# EAGLE design topboard-v1 (EAGLE 9.4.0)
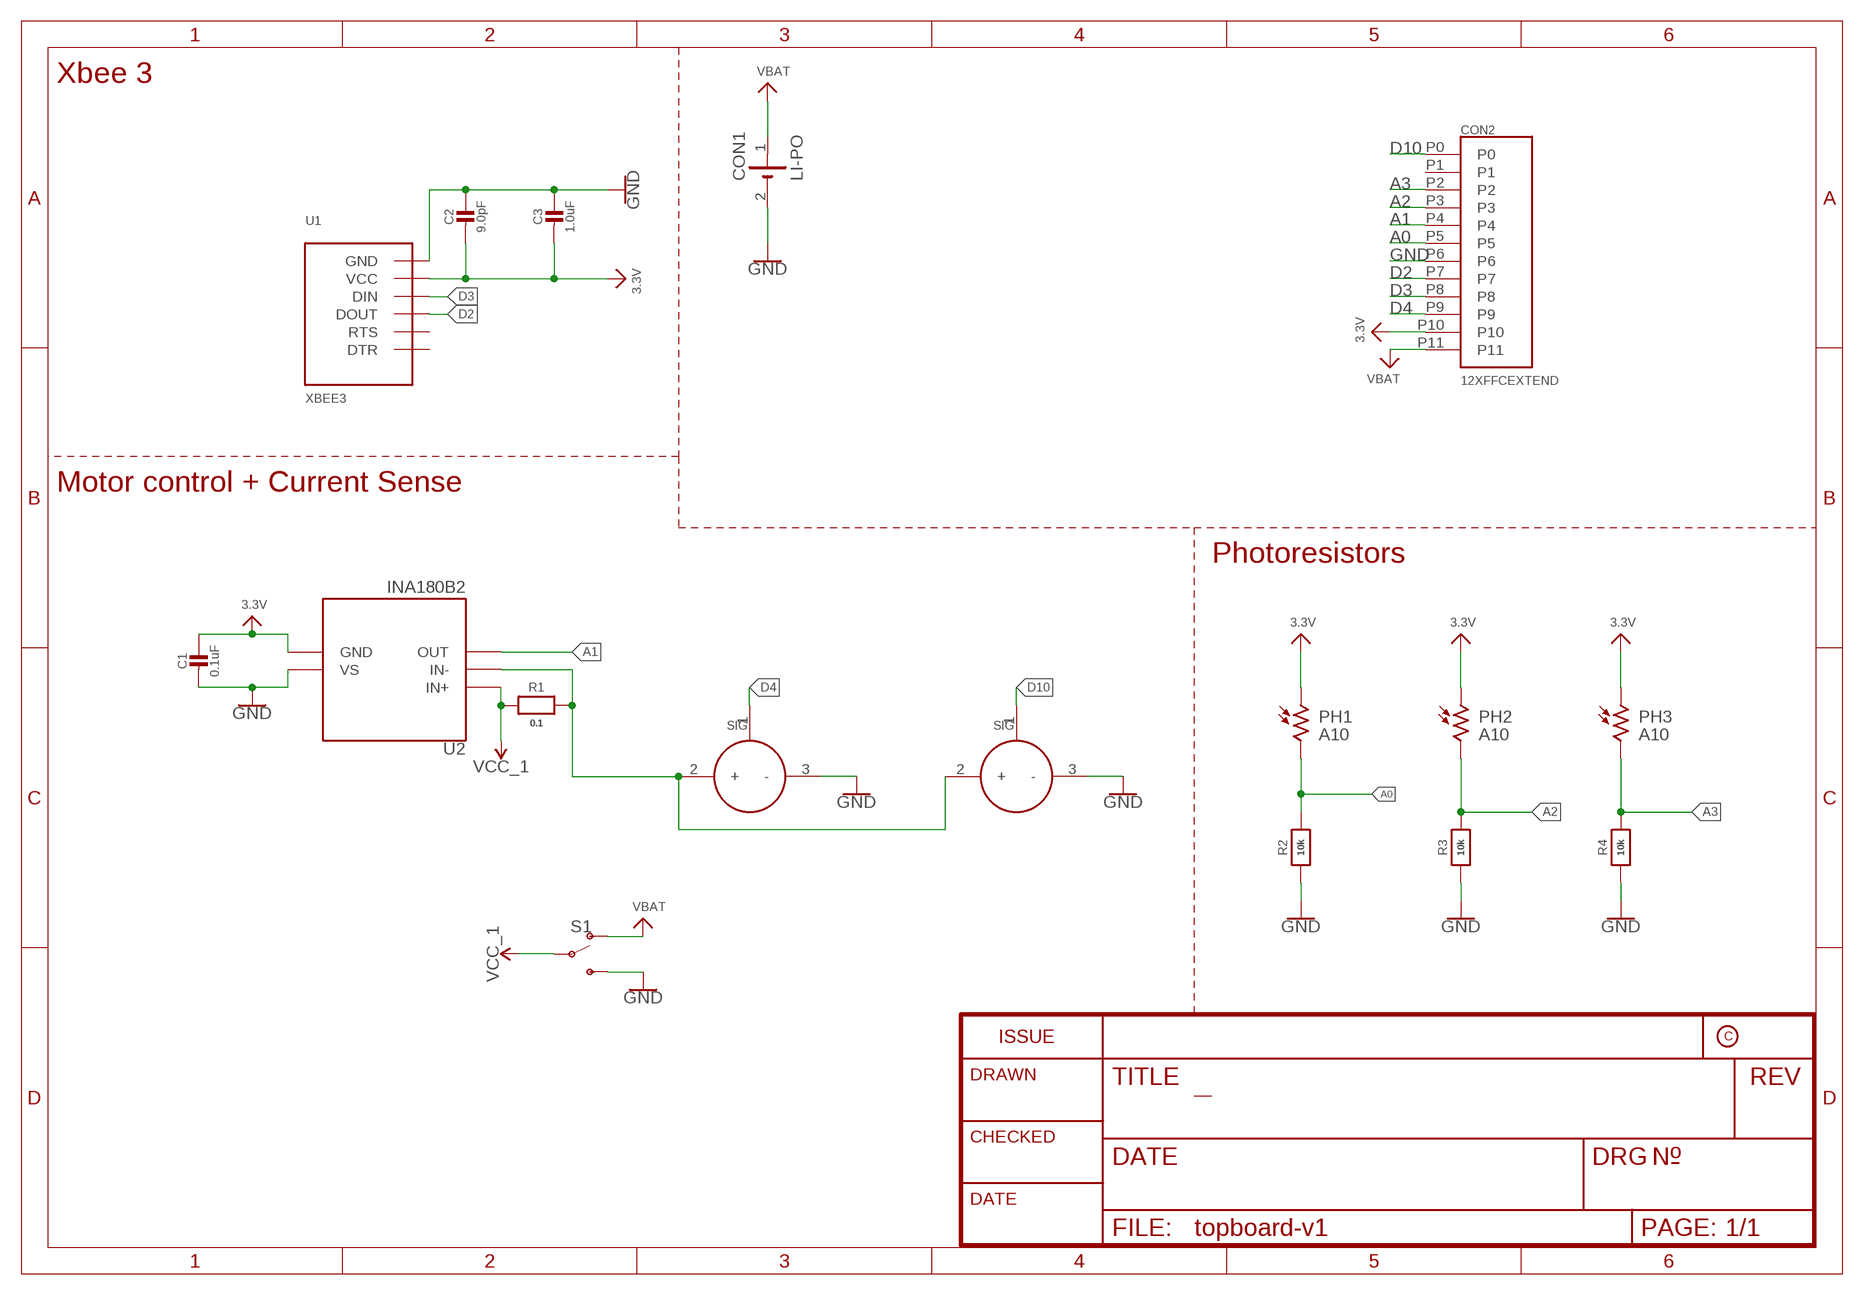
[diagram p0: schematic, sheet 1]

## Parts
C1  0.1uF  CAP_CERAMIC_0603MP  [_0603MP]
C2  9.0pF  CAP_CERAMIC_0603MP  [_0603MP]
C3  1.0uF  CAP_CERAMIC_0603MP  [_0603MP]
CON1  LI-PO  [1X02_BATT]
CON2  12XFFCEXTEND  [15166-0117_XTEND]
M1  SERVO  [1X03_SERVO]
M2  SERVO  [1X03_SERVO]
PH1  A10  [PHOTORESISTOR]
PH2  A10  [PHOTORESISTOR]
PH3  A10  [PHOTORESISTOR]
R1  0.1  RESISTOR_0603MP  [_0603MP]
R2  10k  RESISTOR_0603MP  [_0603MP]
R3  10k  RESISTOR_0603MP  [_0603MP]
R4  10k  RESISTOR_0603MP  [_0603MP]
S1  SWITCH-SPDT-SMD-RIGHT-ANGLE  [SWITCH_SPST_SMD_A]
U1  XBEE3  [XBEE3_MICRO]
U2  INA180B2  [SOT23-5]

## Nets
3.3V: C1.1 C2.2 C3.2 CON2.P10 PH1.1 PH2.1 PH3.1 U1.VCC U2.2(GND)
A0: CON2.P5 PH1.2 R2.2
A1: CON2.P4 U2.4(OUT)
A2: CON2.P3 PH2.2 R3.2
A3: CON2.P2 PH3.2 R4.2
D2: CON2.P7 U1.DOUT/DIO13(DOUT)
D3: CON2.P8 U1.DIN/CONFIG/DIO14(DIN)
D4: CON2.P9 M1.1(SIG)
D10: CON2.P0 M2.1(SIG)
GND: C1.2 C2.1 C3.1 CON1.2(-) CON2.P6 M1.3(-) M2.3(-) R2.1 R3.1 R4.1 S1.3(S) U1.GND1(GND) U1.GND2(GND) U1.GND3(GND) U1.GND4(GND) U1.GND5(GND) U1.GND6(GND) U2.5(VS)
N$1: M1.2(+) M2.2(+) R1.2 U2.3(IN-)
VBAT: CON1.1(+) CON2.P11 S1.1(O)
VCC_1: R1.1 S1.2(P) U2.1(IN+)
Unconnected: CON2.P1 U1.DTR/SLEEP_RQ/DIO8(DTR) U1.RTS/DIO6(RTS)

## Notes on the sheet
- Xbee 3
- Motor control + Current Sense
- Photoresistors

## Library data of the parts
C1-C3 = NU-Smarticle v2:CAP_CERAMIC: Ceramic Capacitors For new designs, use the packages preceded by an '_' character since they are more reliable: The following footprints should be used on most boards: _0402 - Standard footprint for regular board layouts _0603 - Standard footprint for regular board layouts _0805 - Standard footprint for regular board layouts _1206 - Standard footprint for regular board layouts For extremely tight-pitch boards where space is at a premium, the following 'micro-pitch' footprints can be used (smaller pads, no silkscreen outline, etc.): _0402MP - Micro-pitch footprint for very dense/compact boards _0603MP - Micro-pitch footprint for very dense/compact boards _0805MP - Micro-pitch footprint for very dense/compact boards _1206MP - Micro-pitch footprint for very dense/compact boards
CON1 = NU-Smarticle v2:LI-PO: Pins connecting to LiPo Battery
CON2 = NU-Smarticle v2:12XFFC
M1 M2 = NU-Smarticle v2:SERVO
PH1-PH3 = NU-Smarticle v2:A10: Sensor Robust Light Sensing Applications Outdoor Light Sensing Application Source: http://optoelectronics.perkinelmer.com/content/Datasheets/DTS_PhotocellsA1050.pdf
R1-R4 = NU-Smarticle v2:RESISTOR: Resistors For new designs, use the packages preceded by an '_' character since they are more reliable: The following footprints should be used on most boards: _0402 - Standard footprint for regular board layouts _0603 - Standard footprint for regular board layouts _0805 - Standard footprint for regular board layouts _1206 - Standard footprint for regular board layouts For extremely tight-pitch boards where space is at a premium, the following 'micro-pitch' footprints can be used (smaller pads, no silkscreen outline, etc.): _0402MP - Micro-pitch footprint for very dense/compact boards _0603MP - Micro-pitch footprint for very dense/compact boards _0805MP - Micro-pitch footprint for very dense/compact boards _1206MP - Micro-pitch footprint for very dense/compact boards
S1 = CabelBot:SWITCH-SPDT: Single Pole, Double Throw (SPDT) Switch Single-pole, double-throw (SPDT) switch. Variant Overview SMD-AYZ0202 Surface Mount DPDT Switch <https://www.sparkfun.com/products/597> (COM-00597) Used on e.g. LilyPad Arduino USB - ATmega32U4 Board <https://www.sparkfun.com/products/12049> PTH-11.6X4.0MM SPDT Mini Power Switch <https://www.sparkfun.com/products/102> (COM-00102) Used on e.g. SparkFun Simon Says - Through-Hole Soldering Kit <https://www.sparkfun.com/products/10547> (KIT-10547) PTH-11.6X4.0MM-KIT KIT version of SPDT Mini Power Switch - Simplifies soldering by removing tStop of switch pins - only one side can be soldered. PTH-11.6X4.0MM-LOCK LOCK version of SPDT Mini Power Switch - Offset pins hold switch in place for easier soldering. SMD-RIGHT-ANGLE Surface Mount Right Angle Switch <https://www.sparkfun.com/products/10860> (COM-10860) Used on e.g. SparkFun ESP8266 Thing <https://www.sparkfun.com/products/13231>; PROD_ID: SWCH-10651; SF_SKU: COM-10860
U1 = NU-Smarticle v2:XBEE3: XBee 3 802.15
U2 = NU-Smarticle v2:INA180B2: 50x gain current sense amplifier

## Board
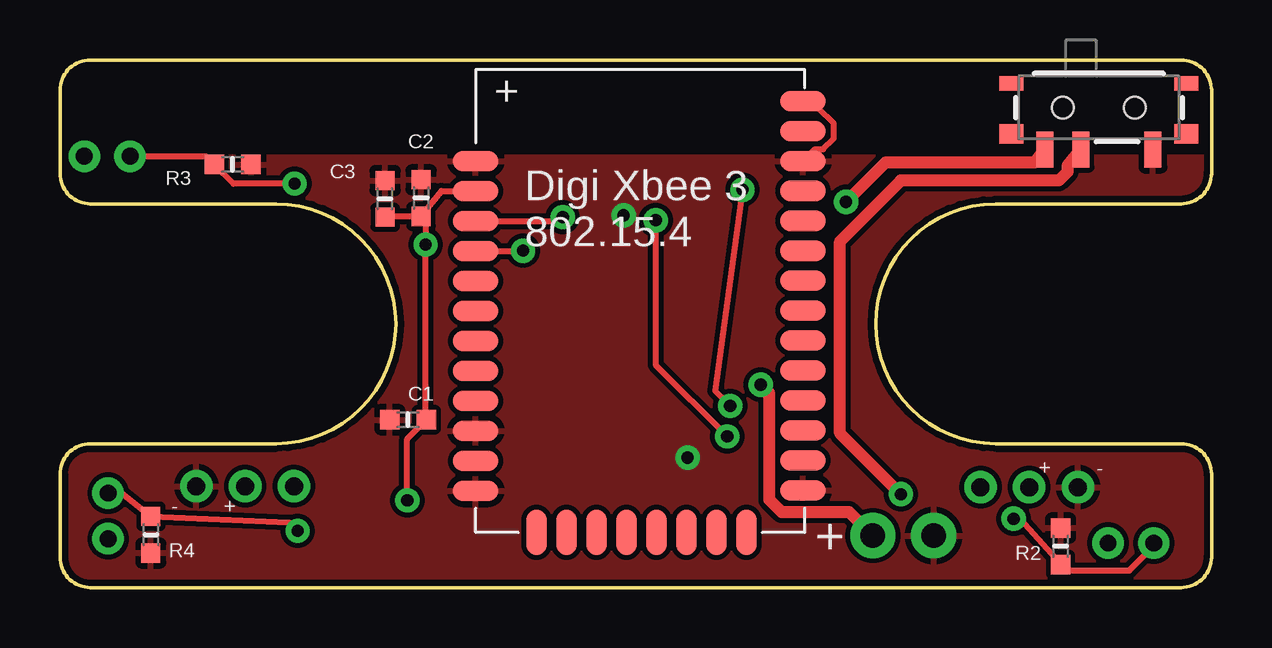
[diagram p1: board, top side]
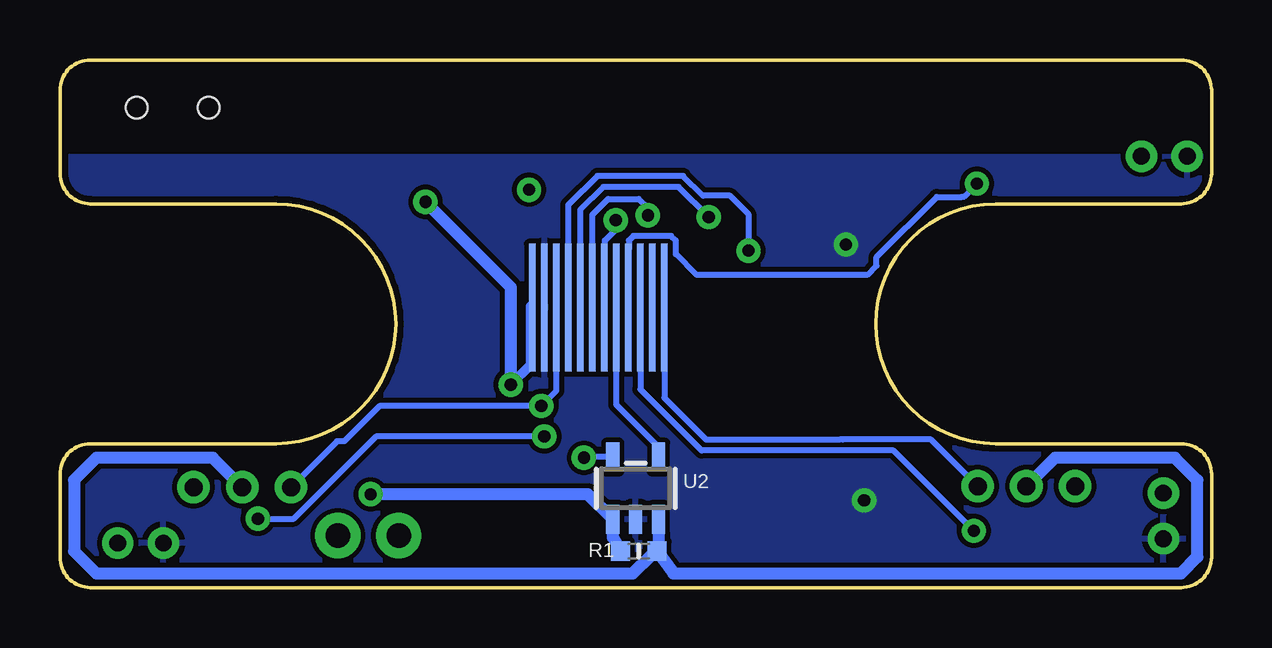
[diagram p2: board, bottom side, seen from below]

Size 48 x 22 mm. Coordinates in mm from the lower left corner, seen from the top.
Outline: 0,4.73 0,1.27 arc90 1.27,0 46.73,0 arc90 48,1.27 48,4.73 arc90 46.73,6 39,6 arc-180 39,16 46.73,16 arc90 48,17.27 48,20.73 arc90 46.73,22 1.27,22 arc90 0,20.73 0,17.27 arc90 1.27,16 9,16 arc-180 9,6 1.27,6 arc90 0,4.73
Copper layers (1*16): Top 0.035mm / dielectric 1.5mm / Bottom 0.035mm
Design rules "SparkFun": minimum track width 8mil, minimum drill 20mil, track to track 8mil, track to pad 8mil, pad to pad 8mil, via to via 8mil, smd to smd 8mil, copper to edge 10mil, drill to drill 8mil, minimum pad ring 12mil, minimum via ring 10mil, stop-mask expansion 4mil, vias tented up to drill 25mil, thermal gap 10mil

### Footprints (pad centres in the part's own frame; a part is rotated, then mirrored left to right if it is on the bottom)
_0603MP = smd 0.8 x 0.8: 1 -0.762,0; 2 0.762,0
1X02_BATT = drill 1.016 pad 1.88: 1 0,0; 2 2.54,0
15166-0117_XTEND = smd 0.279 x 5.334: P0 0,2; P1 0.5,2; P2 1,2; P3 1.5,2; P4 2,2; P5 2.5,2; P6 3,2; P7 3.5,2; P8 4,2; P9 4.5,2; P10 5,2; P11 5.5,2
1X03_SERVO = drill 0.75: 1 0,0; 2 2.032,0; 3 4.064,0
PHOTORESISTOR = drill 0.7: 1 0,0; 2 1.905,0
SWITCH_SPST_SMD_A = smd 0.7 x 1.5: 1 -2.25,-1.75; 2 -0.75,-1.75; 3 2.25,-1.75 | smd 1 x 0.6: GND1 -3.65,1; GND3 3.65,1 | smd 1 x 0.8: GND2 -3.65,-1.1; GND4 3.65,-1.1 | hole 0.9: -1.5,0; 1.5,0
XBEE3_MICRO = smd 0.864 x 1.905: [RESERVED1] 0.681,-9.652; [RESERVED2] 1.93,-9.652; [RESERVED3] 3.18,-9.652; [RESERVED4] 4.43,-9.652; SPI_CLK/DIO18 -4.318,-9.652; SPI_MOSI/DIO15 -0.569,-9.652; SPI_MOSI/DIO16 -1.819,-9.652; SPI_SSEL/DIO17 -3.068,-9.652 | smd 1.905 x 0.864: [RESERVED5] 6.782,-6.65; AD0/DIO0 6.782,4.597; AD1/DIO1 6.782,3.348; AD2/DIO2 6.782,2.098; AD3/DIO3 6.782,0.848; ASSOCIATE/DIO5 6.782,-1.651; CTS/DIO7 6.782,-4.15; DIN/CONFIG/DIO14 -6.858,2.093; DIO4 6.782,-5.4; DIO12 -6.858,0.843; DOUT/DIO13 -6.858,3.343; DTR/SLEEP_RQ/DIO8 -6.858,-4.155; GND1 -6.858,5.842; GND2 -6.858,-5.405; GND3 -6.858,-7.904; GND4 6.782,-7.899; GND5 6.782,5.847; GND6 6.782,8.346; ON/SLEEP/DIO9 6.782,-2.901; PWM1/DIO11 -6.858,-2.906; RF 6.782,7.097; RSSI_PWM/DIO10 -6.858,-1.656; RST -6.858,-0.406; RTS/DIO6 6.782,-0.401; SPI_ATTN/BOOTMODE/DIO19 -6.858,-6.655; VCC -6.858,4.592
SOT23-5 = smd 0.55 x 1.2: 1 -0.95,-1.3; 2 0,-1.3; 3 0.95,-1.3; 4 0.95,1.3; 5 -0.95,1.3

### Placement (x,y rotation side)
C1  14.51,7 180 top
C2  15.06,16.24 270 top
C3  13.55,16.2 270 top
CON1  33.88,2.17 0 top
CON2  22.81,13.67 180 bottom
M1  38.37,4.18 0 top
M2  9.75,4.23 180 top
PH1  43.69,1.86 0 top
PH2  1.02,17.99 0 top
PH3  2.01,2.03 90 top
R1  23.88,1.52 0 bottom
R2  41.71,1.72 270 top
R3  7.2,17.64 180 top
R4  3.79,2.2 90 top
S1  43.31,20.02 0 top
U1  24.19,11.94 0 top
U2  24.01,4.14 0 bottom

### Tracks (layer width: path | path; a pad name or v marks a point on that pad's centre or on a via)
3.3V  (via drill 0.51)
  Top 0.254: C2.2 15.91,16.54 U1.VCC | C3.2 13.59,15.48 C2.2 | C2.2 15.24,15.3 v15.24,14.3 15.24,7.03 C1.1 14.48,6.21 v14.48,3.63
  pour Bottom: 48.01,17.97 0,17.97 0,15.06 0,5.92 0,-0.05 48.13,-0.05 47.88,6.05
A0  (via drill 0.51)
  Top 0.254: v24.83,15.32 24.83,9.28 v27.81,6.3 | PH1.2 45.59,1.73 44.58,0.71 41.72,0.71 R2.2 40,2.87 v39.75,2.87
  Bottom 0.254: v27.81,6.3 34.82,6.3 38.26,2.87 v39.75,2.87 | CON2.P5 25.29,11.69 25.29,14.47 24.83,14.93 v24.83,15.32
A1
  Bottom 0.254: U2.4 23.06,5.86 24.81,7.62 CON2.P4
A2  (via drill 0.51)
  Top 0.254: PH2.2 6.09,17.99 R3.2 7.24,16.84 v9.78,16.84
  Bottom 0.254: v9.78,16.84 10.31,16.31 10.42,16.29 11.46,16.29 13.96,13.78 13.96,13.42 14.35,13.03 21.46,13.03 22.33,13.9 22.33,14.47 22.52,14.66 24.1,14.66 24.29,14.47 24.29,14.09 24.33,14.05 24.33,11.69 CON2.P3
A3  (via drill 0.51)
  Top 0.254: PH3.2 2.56,3.94 R4.2 9.56,2.71 v9.91,2.37
  Bottom 0.254: v9.91,2.37 13.26,5.72 21.26,5.72 23.81,8.27 CON2.P2
D2  (via drill 0.51)
  Top 0.254: U1.DOUT/DIO13 20.86,15.29 v20.95,15.45
  Bottom 0.254: CON2.P7 26.31,15.75 25.35,16.71 22.22,16.71 v20.95,15.45
D3  (via drill 0.51)
  Top 0.254: U1.DIN/CONFIG/DIO14 19.29,14.04 v19.3,14.05
  Bottom 0.254: v19.3,14.05 19.3,15.57 20.07,16.34 21.2,16.34 22.03,17.16 25.6,17.16 26.81,15.96 CON2.P8
D4  (via drill 0.51)
  Top 0.254: v28.45,16.59 27.3,8.21 v27.94,7.57
  Bottom 0.254: M1.1 36.45,6.1 36.15,6.1 34.68,7.57 v27.94,7.57 27.31,8.2 CON2.P9
D10
  Bottom 0.254: M2.1 11.7,6.17 15.37,6.17 15.49,6.17 21.07,6.17 22.81,7.91 CON2.P0
GND  (via drill 0.51)
  Top 0.254: U1.GND5 31.46,18.28 31.81,18.28 32.26,18.73 32.26,19.36 31.62,19.99 31.62,20.4 31.08,20.4 U1.GND6
  Bottom 0.254: U2.5 26.13,5.44 v26.16,5.41 | CON2.P6 25.81,15.54 25.15,16.21 23.88,16.21 23.5,15.83 v23.5,15.52
  pour Top: 0,6 0,0 48,0 48,6 48,15 48,17.99 43,18 0,18
N$1
  Bottom 0.508: U2.3 23.06,1.84 R1.2 | R1.2 23.37,1.34 24.13,0.58 46.48,0.58 47.42,1.52 47.42,4.48 46.48,5.42 45.09,5.42 44.1,5.42 41.63,5.42 M1.2 | R1.2 22.43,0.59 1.27,0.59 0.58,1.27 0.58,4.47 1.53,5.42 6.53,5.42 M2.2
VBAT  (via drill 0.51)
  Top 0.508: v29.21,8.46 29.56,8.11 29.56,3.68 30.08,3.16 32.89,3.16 CON1.1 | v32.77,16.08 34.42,17.73 40.65,17.73 S1.1
  Bottom 0.254: CON2.P11 28.37,11.72
  Bottom 0.406: v29.21,8.46 28.37,9.3 28.37,11.72
  Bottom 0.508: v29.21,8.46 29.21,12.53 v32.77,16.08
VCC_1  (via drill 0.51)
  Top 0.508: S1.2 41.99,17.57 41.99,17.33 41.63,16.97 35.05,16.97 32.51,14.43 32.51,6.43 v35.05,3.89
  Bottom 0.508: R1.1 24.96,2.09 U2.1 26,3.89 v35.05,3.89